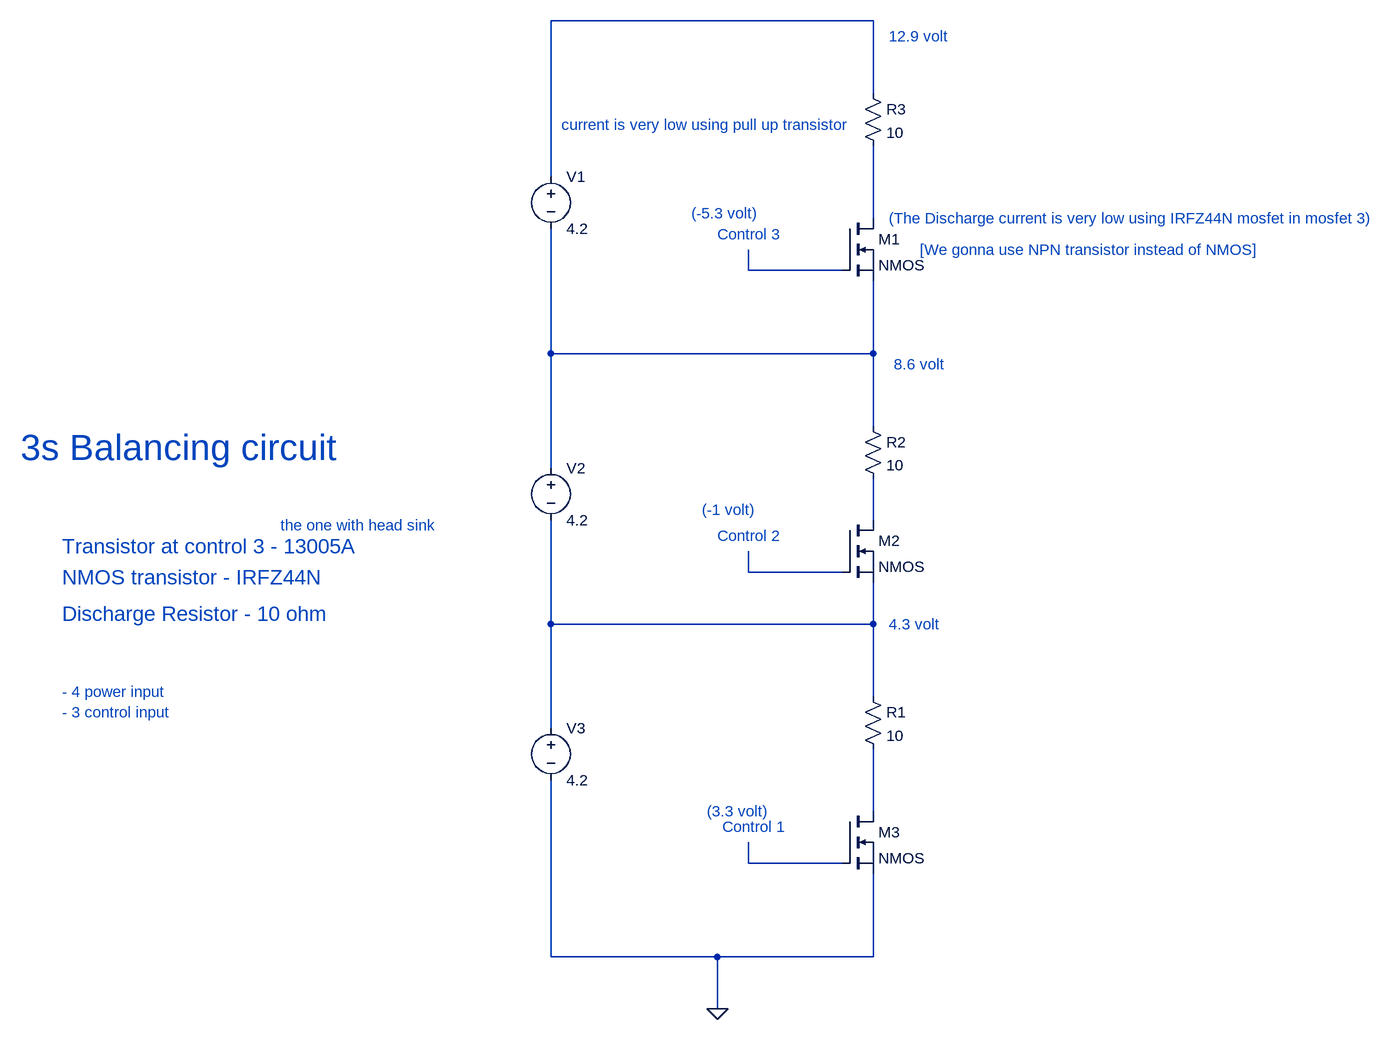
[diagram p0: schematic 3S cell balancing circuit.asc]
3S cell balancing circuit.asc, the LTspice schematic file:
Version 4
SHEET 1 1508 1332
WIRE 672 -208 176 -208
WIRE 672 -96 672 -208
WIRE 176 32 176 -208
WIRE 672 96 672 -16
WIRE 480 176 480 144
WIRE 624 176 480 176
WIRE 176 304 176 112
WIRE 672 304 672 192
WIRE 672 304 176 304
WIRE 672 416 672 304
WIRE 176 480 176 304
WIRE 672 560 672 496
WIRE 480 640 480 608
WIRE 624 640 480 640
WIRE 176 720 176 560
WIRE 672 720 672 656
WIRE 672 720 176 720
WIRE 672 832 672 720
WIRE 176 880 176 720
WIRE 672 1008 672 912
WIRE 480 1088 480 1056
WIRE 624 1088 480 1088
WIRE 176 1232 176 960
WIRE 432 1232 176 1232
WIRE 672 1232 672 1104
WIRE 672 1232 432 1232
WIRE 432 1312 432 1232
FLAG 432 1312 0
SYMBOL voltage 176 16 R0
WINDOW 123 0 0 Left 0
WINDOW 39 0 0 Left 0
SYMATTR InstName V1
SYMATTR Value 4.2
SYMBOL voltage 176 464 R0
WINDOW 123 0 0 Left 0
WINDOW 39 0 0 Left 0
SYMATTR InstName V2
SYMATTR Value 4.2
SYMBOL voltage 176 864 R0
WINDOW 123 0 0 Left 0
WINDOW 39 0 0 Left 0
SYMATTR InstName V3
SYMATTR Value 4.2
SYMBOL nmos 624 96 R0
SYMATTR InstName M1
SYMBOL nmos 624 560 R0
SYMATTR InstName M2
SYMBOL nmos 624 1008 R0
SYMATTR InstName M3
SYMBOL res 656 816 R0
SYMATTR InstName R1
SYMATTR Value 10
SYMBOL res 656 400 R0
SYMATTR InstName R2
SYMATTR Value 10
SYMBOL res 656 -112 R0
SYMATTR InstName R3
SYMATTR Value 10
TEXT 440 1032 Left 2 ;Control 1
TEXT 432 584 Left 2 ;Control 2
TEXT 432 120 Left 2 ;Control 3
TEXT -640 448 Left 5 ;3s Balancing circuit
TEXT 696 720 Left 2 ;4.3 volt
TEXT 704 320 Left 2 ;8.6 volt
TEXT 696 -184 Left 2 ;12.9 volt
TEXT 416 1008 Left 2 ;(3.3 volt)
TEXT 408 544 Left 2 ;(-1 volt)
TEXT 392 88 Left 2 ;(-5.3 volt)
TEXT 192 -48 Left 2 ;current is very low using pull up transistor
TEXT 696 96 Left 2 ;(The Discharge current is very low using IRFZ44N mosfet in mosfet 3)
TEXT -576 648 Left 3 ;NMOS transistor - IRFZ44N
TEXT -576 704 Left 3 ;Discharge Resistor - 10 ohm
TEXT -576 600 Left 3 ;Transistor at control 3 - 13005A
TEXT 744 144 Left 2 ;[We gonna use NPN transistor instead of NMOS]
TEXT -240 568 Left 2 ;the one with head sink
TEXT -576 824 Left 2 ;- 4 power input
TEXT -576 856 Left 2 ;- 3 control input

The netlist it stands for:
* 3S cell balancing circuit.asc
V1 N001 N004 4.2
V2 N004 N007 4.2
V3 N007 0 4.2
M1 N002 N003 N004 N004 NMOS
M2 N005 N006 N007 N007 NMOS
M3 N008 N009 0 0 NMOS
R1 N007 N008 10
R2 N004 N005 10
R3 N001 N002 10
.model NMOS NMOS
.model PMOS PMOS
.lib standard.mos
* Control 1
* Control 2
* Control 3
* 3s Balancing circuit
* 4.3 volt
* 8.6 volt
* 12.9 volt
* (3.3 volt)
* (-1 volt)
* (-5.3 volt)
* current is very low using pull up transistor
* (The Discharge current is very low using IRFZ44N mosfet in mosfet 3)
* NMOS transistor - IRFZ44N
* Discharge Resistor - 10 ohm
* Transistor at control 3 - 13005A
* [We gonna use NPN transistor instead of NMOS]
* the one with head sink
* - 4 power input
* - 3 control input
.backanno
.end